# EAGLE schematic miniDIN4_spacer (EAGLE 9.1.3)
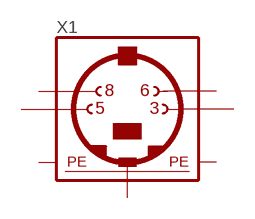
[diagram p0: schematic, sheet 1]

## Parts
X1  MINI_DIN_4  [M_DIN4]
Unconnected: X1.3 X1.5 X1.6 X1.8

## Power pins joined to a net without a drawn wire
PE1: X1.SH1(PE1)
PE2: X1.SH2(PE2)
PE3: X1.SH3(PE3)

## Library data of the parts
X1 = mini_din:MINI_DIN_4